# EAGLE schematic Alat_Cuci_Beras (EAGLE 9.6.2)
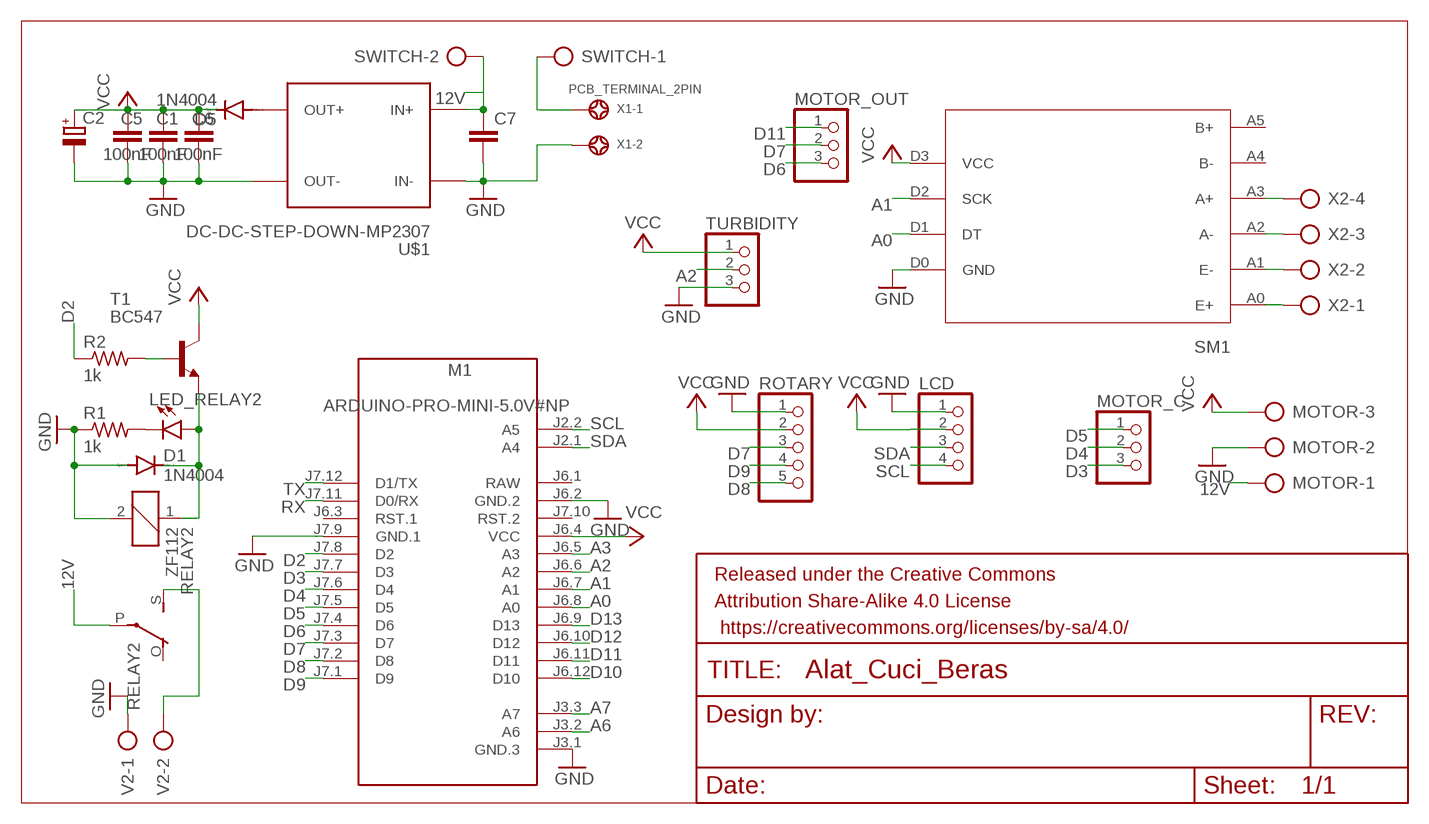
[diagram p0: schematic, sheet 1]

## Parts
C1  100nF  C-EUC0805K  [C0805K]
C2  CPOL-EUE2.5-6  [E2,5-6]
C5  100nF  C-EUC0805K  [C0805K]
C6  100nF  C-EUC0805K  [C0805K]
C7  C-EU050-030X075  [C050-030X075]
D1  1N4004  [DO41-10]
D5  1N4004  [DO41-10]
FRAME1  FRAME-LETTER  [CREATIVE_COMMONS]
LCD  PINHD-1X4  [1X04]
LED_RELAY2  LED3MM  [LED_3MM]
M1  ARDUINO-PRO-MINI-5.0V#NP  [ARDUINO-PRO-MINI#NP]
MOTOR  AK500/3  [AK500/3]
MOTOR_C  PINHD-1X3  [1X03]
MOTOR_OUT  PINHD-1X3  [1X03]
R1  1k  R-US_R0805  [R0805]
R2  1k  R-US_0207/10  [0207/10]
RELAY2  ZF112  [ZF112]
ROTARY  PINHD-1X5  [1X05]
SM1  HX711  [HX711]
SWITCH  AK500/2  [AK500/2]
T1  BC547  [TO92]
TURBIDITY  PINHD-1X3  [1X03]
U$1  DC-DC-STEP-DOWN-MP2307  [DC-DC-STEP-DOWN-MP2307]
V2  AK500/2  [AK500/2]
X1  PCB_TERMINAL_2PIN  [PCB_TERMINAL_2PIN]
X2  AK500/4  [AK500/4]

## Nets
12V: C7.1 MOTOR.1 RELAY2.P(2:P) SWITCH.2 U$1.IN+
A0: M1.J6.8(A0) SM1.D1(DT)
A1: M1.J6.7(A1) SM1.D2(SCK)
A2: M1.J6.6(A2) TURBIDITY.2
A3: M1.J6.5(A3)
A6: M1.J3.2(A6)
A7: M1.J3.3(A7)
D2: M1.J7.8(D2) R2.1
D3: M1.J7.7(D3) MOTOR_C.3
D4: M1.J7.6(D4) MOTOR_C.2
D5: M1.J7.5(D5) MOTOR_C.1
D6: M1.J7.4(D6) MOTOR_OUT.3
D7: M1.J7.3(D7) MOTOR_OUT.2 ROTARY.3
D8: M1.J7.2(D8) ROTARY.5
D9: M1.J7.1(D9) ROTARY.4
D10: M1.J6.12(D10)
D11: M1.J6.11(D11) MOTOR_OUT.1
D12: M1.J6.10(D12)
D13: M1.J6.9(D13)
GND: C1.2 C2.- C5.2 C6.2 C7.2 D1.A LCD.1 M1.J3.1(GND.3) M1.J6.2(GND.2) M1.J7.9(GND.1) MOTOR.2 R1.1 RELAY2.2 ROTARY.1 SM1.D0(GND) TURBIDITY.3 U$1.IN- U$1.OUT- V2.1 X1.2
N$1: D1.C LED_RELAY2.A RELAY2.1 T1.1(E)
N$2: SWITCH.1 X1.1
N$3: D5.A U$1.OUT+
N$4: LED_RELAY2.K(C) R1.2
N$5: R2.2 T1.2(B)
N$6: SM1.A0(E+) X2.1
N$7: SM1.A1(E-) X2.2
N$8: SM1.A2(A-) X2.3
N$9: RELAY2.S(2:S) V2.2
N$10: SM1.A3(A+) X2.4
RX: M1.J7.11(D0/RX)
SCL: LCD.4 M1.J2.2(A5)
SDA: LCD.3 M1.J2.1(A4)
TX: M1.J7.12(D1/TX)
VCC: C1.1 C2.+ C5.1 C6.1 D5.C LCD.2 M1.J6.4(VCC) MOTOR.3 ROTARY.2 SM1.D3(VCC) T1.3(C) TURBIDITY.1
Unconnected: M1.J6.3(RST.1) M1.J7.10(RST.2) RELAY2.O(2:O) SM1.A4(B-) SM1.A5(B+)

## Power pins joined to a net without a drawn wire
RAW: M1.J6.1(RAW)

## Library data of the parts
C1 C5-C7 = rcl:C-EU: CAPACITOR, European symbol; SPICEPREFIX: C
C2 = rcl:CPOL-EU: POLARIZED CAPACITOR, European symbol; SPICEPREFIX: C
D1 D5 = diode:1N4004: DIODE general purpose rectifier, 1 A
FRAME1 = SparkFun-Aesthetics:FRAME-LETTER: Schematic Frame - Letter Standard 8.5x11 US Letter frame
LCD = pinhead:PINHD-1X4: PIN HEADER
LED_RELAY2 = SparkFun-LED:LED: LED (Generic) Standard schematic elements and footprints for 5mm, 3mm, 1206, and 0603 sized LEDs. Generic LEDs with no color specified.; PROD_ID: DIO-08794
M1 = diy-modules:ARDUINO-PRO-MINI-*#NP: Arduino Pro Mini (and compatible devices) without programming pads More details available here: https://www.arduino.cc/en/Main/ArduinoBoardProMini Click here to find device on ebay.com <http://www.ebay.com/sch/arduino+pro+mini>
MOTOR = con-ptr500:AK500/3: CONNECTOR; OC_FARNELL: unknown; OC_NEWARK: unknown
MOTOR_C MOTOR_OUT TURBIDITY = pinhead:PINHD-1X3: PIN HEADER
R1 R2 = rcl:R-US_: RESISTOR, American symbol; SPICEPREFIX: R
RELAY2 = relay:ZF112: RELAY 1 x switch; OC_FARNELL: unknown; OC_NEWARK: unknown
ROTARY = pinhead:PINHD-1X5: PIN HEADER
SM1 = hx711:HX711: HX711 module is a Load Cell Amplifier breakout board for the HX711 IC that allows you to easily read load cells to measure weight. This module uses 24 high precision A/D converter chip HX711. It is a specially designed for the high precision electronic scale design, with two analog input channel, the internal integration of 128 times the programmable gain amplifier. The input circuit can be configured to provide a bridge type pressure bridge (such as pressure, weighing sensor mode), is of high precision, low cost is an ideal sampling front-end module.
SWITCH V2 = con-ptr500:AK500/2: CONNECTOR; OC_FARNELL: unknown; OC_NEWARK: unknown
T1 = transistor:BC547: NPN TRANSISTOR
U$1 = diy-modules:DC-DC-STEP-DOWN-MP2307: DC/DC Step-Down Regulator based on MP2307DN chip MP2307 datasheet available here: https://cdn-shop.adafruit.com/datasheets/MP2307_r1.9.pdf Click here to find device on ebay.com <http://www.ebay.com/sch/dc+dc+3a+mini+converter>
X1 = PCB_Terminal:PCB_TERMINAL_2PIN
X2 = con-ptr500:AK500/4: CONNECTOR; OC_FARNELL: unknown; OC_NEWARK: unknown